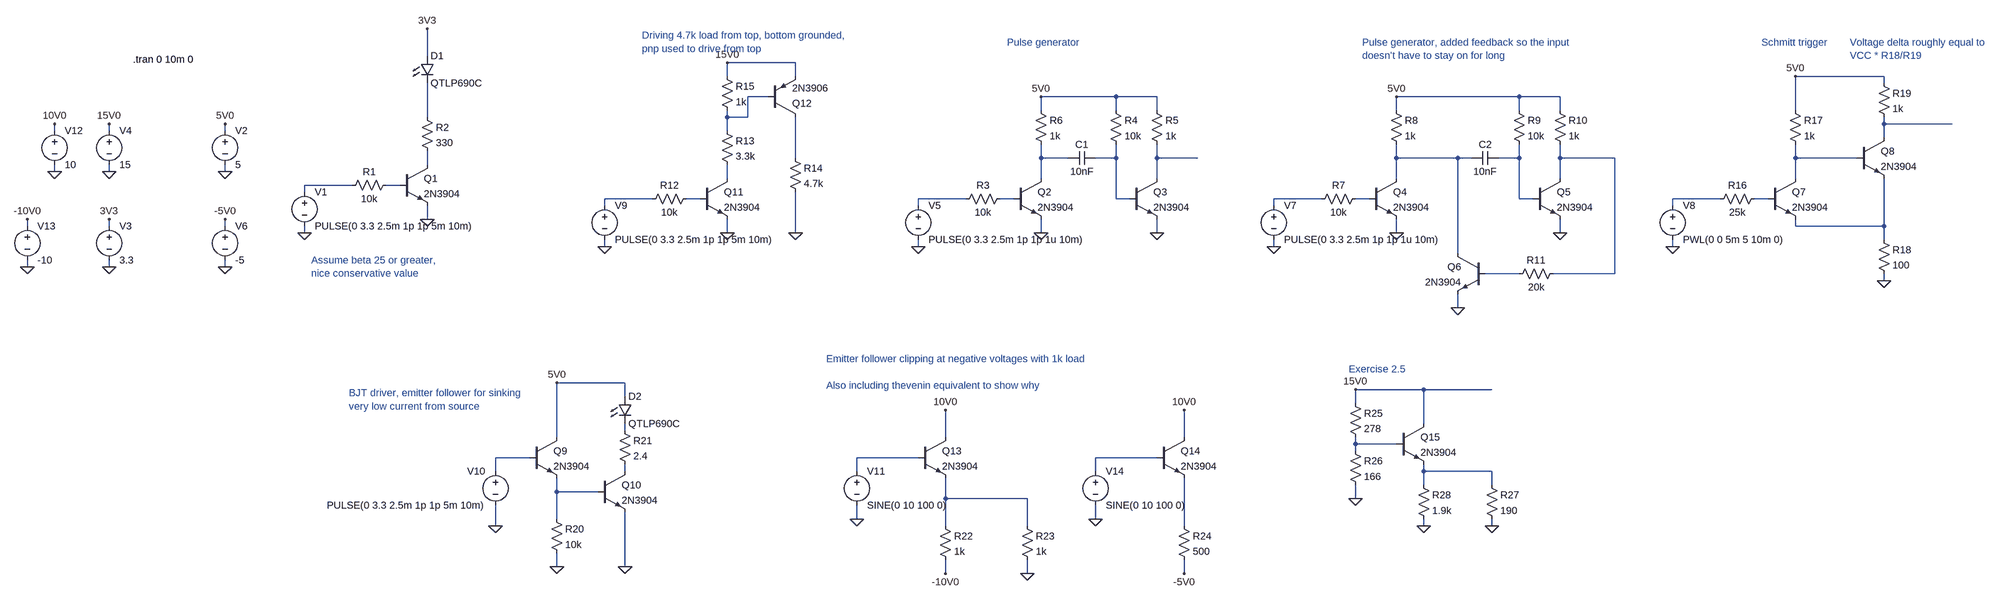
[diagram p0: schematic BJTs.asc]
BJTs.asc, the LTspice schematic file:
Version 4
SHEET 1 4136 1636
WIRE 160 208 160 144
WIRE 1024 224 864 224
WIRE 864 256 864 224
WIRE 1024 256 1024 224
WIRE 3728 256 3520 256
WIRE 3728 272 3728 256
WIRE 960 304 912 304
WIRE 1776 304 1600 304
WIRE 1872 304 1776 304
WIRE 2752 304 2464 304
WIRE 2848 304 2752 304
WIRE 1600 336 1600 304
WIRE 1776 336 1776 304
WIRE 1872 336 1872 304
WIRE 2464 336 2464 304
WIRE 2752 336 2752 304
WIRE 2848 336 2848 304
WIRE 3520 336 3520 256
WIRE 160 352 160 272
WIRE 864 352 864 336
WIRE 912 352 912 304
WIRE 912 352 864 352
WIRE 3728 368 3728 352
WIRE 3888 368 3728 368
WIRE -736 384 -736 368
WIRE -608 384 -608 368
WIRE -336 384 -336 368
WIRE 864 384 864 352
WIRE 3728 400 3728 368
WIRE 1024 448 1024 352
WIRE 1600 448 1600 416
WIRE 1664 448 1600 448
WIRE 1776 448 1776 416
WIRE 1776 448 1728 448
WIRE 1872 448 1872 416
WIRE 1968 448 1872 448
WIRE 2464 448 2464 416
WIRE 2608 448 2464 448
WIRE 2640 448 2608 448
WIRE 2752 448 2752 416
WIRE 2752 448 2704 448
WIRE 2848 448 2848 416
WIRE 2976 448 2848 448
WIRE 3520 448 3520 416
WIRE 3664 448 3520 448
WIRE 160 464 160 432
WIRE -736 480 -736 464
WIRE -608 480 -608 464
WIRE -336 480 -336 464
WIRE 864 496 864 464
WIRE 1600 496 1600 448
WIRE 1872 496 1872 448
WIRE 2464 496 2464 448
WIRE 2848 496 2848 448
WIRE 3520 496 3520 448
WIRE -16 512 -128 512
WIRE 96 512 64 512
WIRE -128 528 -128 512
WIRE 688 544 576 544
WIRE 800 544 768 544
WIRE 1424 544 1312 544
WIRE 1536 544 1504 544
WIRE 1776 544 1776 448
WIRE 1808 544 1776 544
WIRE 2288 544 2176 544
WIRE 2400 544 2368 544
WIRE 2752 544 2752 448
WIRE 2784 544 2752 544
WIRE 3344 544 3232 544
WIRE 3456 544 3424 544
WIRE 576 560 576 544
WIRE 1312 560 1312 544
WIRE 2176 560 2176 544
WIRE 3232 560 3232 544
WIRE 160 592 160 560
WIRE -800 608 -800 592
WIRE -608 608 -608 592
WIRE -336 608 -336 592
WIRE 3520 608 3520 592
WIRE 3728 608 3728 496
WIRE 3728 608 3520 608
WIRE -128 624 -128 608
WIRE 864 624 864 592
WIRE 1024 624 1024 528
WIRE 1600 624 1600 592
WIRE 1872 624 1872 592
WIRE 2464 624 2464 592
WIRE 2848 624 2848 592
WIRE 3728 640 3728 608
WIRE 576 656 576 640
WIRE 1312 656 1312 640
WIRE 2176 656 2176 640
WIRE 3232 656 3232 640
WIRE 2608 672 2608 448
WIRE -800 704 -800 688
WIRE -608 704 -608 688
WIRE -336 704 -336 688
WIRE 2752 720 2672 720
WIRE 2976 720 2976 448
WIRE 2976 720 2832 720
WIRE 3728 736 3728 720
WIRE 2608 800 2608 768
WIRE 624 976 464 976
WIRE 2528 992 2368 992
WIRE 2688 992 2528 992
WIRE 624 1008 624 976
WIRE 2368 1024 2368 992
WIRE 2528 1072 2528 992
WIRE 624 1088 624 1072
WIRE 464 1104 464 976
WIRE 1376 1104 1376 1040
WIRE 1936 1104 1936 1040
WIRE 2368 1120 2368 1104
WIRE 2464 1120 2368 1120
WIRE 2368 1136 2368 1120
WIRE 400 1152 320 1152
WIRE 1312 1152 1168 1152
WIRE 1872 1152 1728 1152
WIRE 320 1184 320 1152
WIRE 624 1184 624 1168
WIRE 1168 1184 1168 1152
WIRE 1728 1184 1728 1152
WIRE 2528 1184 2528 1168
WIRE 2688 1184 2528 1184
WIRE 2528 1216 2528 1184
WIRE 2688 1216 2688 1184
WIRE 464 1232 464 1200
WIRE 560 1232 464 1232
WIRE 1376 1248 1376 1200
WIRE 1568 1248 1376 1248
WIRE 2368 1248 2368 1216
WIRE 464 1296 464 1232
WIRE 1168 1296 1168 1264
WIRE 1728 1296 1728 1264
WIRE 320 1312 320 1264
WIRE 1376 1312 1376 1248
WIRE 1568 1312 1568 1248
WIRE 1936 1312 1936 1200
WIRE 2528 1312 2528 1296
WIRE 2688 1312 2688 1296
WIRE 464 1408 464 1376
WIRE 624 1408 624 1280
WIRE 1376 1424 1376 1392
WIRE 1568 1424 1568 1392
WIRE 1936 1424 1936 1392
FLAG -336 480 0
FLAG -336 368 5V0
FLAG -608 480 0
FLAG -608 368 15V0
FLAG -336 704 0
FLAG -336 592 -5V0
FLAG 160 592 0
FLAG -128 624 0
FLAG -608 704 0
FLAG -608 592 3V3
FLAG 160 144 3V3
FLAG 864 624 0
FLAG 576 656 0
FLAG 864 224 15V0
FLAG 1024 624 0
FLAG 1600 624 0
FLAG 1312 656 0
FLAG 1600 304 5V0
FLAG 1872 624 0
FLAG 2464 624 0
FLAG 2176 656 0
FLAG 2464 304 5V0
FLAG 2848 624 0
FLAG 2608 800 0
FLAG 3232 656 0
FLAG 3728 736 0
FLAG 3520 256 5V0
FLAG 320 1312 0
FLAG 464 1408 0
FLAG 624 1408 0
FLAG 464 976 5V0
FLAG 1376 1424 -10V0
FLAG 1168 1296 0
FLAG -736 480 0
FLAG -736 368 10V0
FLAG 1376 1040 10V0
FLAG -800 704 0
FLAG -800 592 -10V0
FLAG 1568 1424 0
FLAG 1936 1424 -5V0
FLAG 1728 1296 0
FLAG 1936 1040 10V0
FLAG 2368 992 15V0
FLAG 2368 1248 0
FLAG 2528 1312 0
FLAG 2688 1312 0
SYMBOL voltage -336 368 R0
WINDOW 123 0 0 Left 0
WINDOW 39 0 0 Left 0
SYMATTR InstName V2
SYMATTR Value 5
SYMBOL voltage -608 368 R0
WINDOW 123 0 0 Left 0
WINDOW 39 0 0 Left 0
SYMATTR InstName V4
SYMATTR Value 15
SYMBOL voltage -336 592 R0
WINDOW 123 0 0 Left 0
WINDOW 39 0 0 Left 0
SYMATTR InstName V6
SYMATTR Value -5
SYMBOL npn 96 464 R0
SYMATTR InstName Q1
SYMATTR Value 2N3904
SYMBOL res 80 496 R90
WINDOW 0 0 56 VBottom 2
WINDOW 3 32 56 VTop 2
SYMATTR InstName R1
SYMATTR Value 10k
SYMBOL res 144 336 R0
SYMATTR InstName R2
SYMATTR Value 330
SYMBOL voltage -128 512 R0
WINDOW 123 0 0 Left 0
WINDOW 39 0 0 Left 0
SYMATTR InstName V1
SYMATTR Value PULSE(0 3.3 2.5m 1p 1p 5m 10m)
SYMBOL voltage -608 592 R0
WINDOW 123 0 0 Left 0
WINDOW 39 0 0 Left 0
SYMATTR InstName V3
SYMATTR Value 3.3
SYMBOL LED 144 208 R0
SYMATTR InstName D1
SYMATTR Value QTLP690C
SYMATTR Description Diode
SYMATTR Type diode
SYMBOL npn 800 496 R0
SYMATTR InstName Q11
SYMATTR Value 2N3904
SYMBOL res 784 528 R90
WINDOW 0 0 56 VBottom 2
WINDOW 3 32 56 VTop 2
SYMATTR InstName R12
SYMATTR Value 10k
SYMBOL voltage 576 544 R0
WINDOW 123 0 0 Left 0
WINDOW 39 0 0 Left 0
SYMATTR InstName V9
SYMATTR Value PULSE(0 3.3 2.5m 1p 1p 5m 10m)
SYMBOL res 848 368 R0
SYMATTR InstName R13
SYMATTR Value 3.3k
SYMBOL pnp 960 352 M180
SYMATTR InstName Q12
SYMATTR Value 2N3906
SYMBOL res 1008 432 R0
SYMATTR InstName R14
SYMATTR Value 4.7k
SYMBOL res 848 240 R0
SYMATTR InstName R15
SYMATTR Value 1k
SYMBOL npn 1536 496 R0
SYMATTR InstName Q2
SYMATTR Value 2N3904
SYMBOL res 1520 528 R90
WINDOW 0 0 56 VBottom 2
WINDOW 3 32 56 VTop 2
SYMATTR InstName R3
SYMATTR Value 10k
SYMBOL voltage 1312 544 R0
WINDOW 123 0 0 Left 0
WINDOW 39 0 0 Left 0
SYMATTR InstName V5
SYMATTR Value PULSE(0 3.3 2.5m 1p 1p 1u 10m)
SYMBOL res 1584 320 R0
SYMATTR InstName R6
SYMATTR Value 1k
SYMBOL cap 1728 432 R90
WINDOW 0 0 32 VBottom 2
WINDOW 3 32 32 VTop 2
SYMATTR InstName C1
SYMATTR Value 10nF
SYMBOL res 1760 320 R0
SYMATTR InstName R4
SYMATTR Value 10k
SYMBOL npn 1808 496 R0
SYMATTR InstName Q3
SYMATTR Value 2N3904
SYMBOL res 1856 320 R0
SYMATTR InstName R5
SYMATTR Value 1k
SYMBOL npn 2400 496 R0
SYMATTR InstName Q4
SYMATTR Value 2N3904
SYMBOL res 2384 528 R90
WINDOW 0 0 56 VBottom 2
WINDOW 3 32 56 VTop 2
SYMATTR InstName R7
SYMATTR Value 10k
SYMBOL voltage 2176 544 R0
WINDOW 123 0 0 Left 0
WINDOW 39 0 0 Left 0
SYMATTR InstName V7
SYMATTR Value PULSE(0 3.3 2.5m 1p 1p 1u 10m)
SYMBOL res 2448 320 R0
SYMATTR InstName R8
SYMATTR Value 1k
SYMBOL cap 2704 432 R90
WINDOW 0 0 32 VBottom 2
WINDOW 3 32 32 VTop 2
SYMATTR InstName C2
SYMATTR Value 10nF
SYMBOL res 2736 320 R0
SYMATTR InstName R9
SYMATTR Value 10k
SYMBOL npn 2784 496 R0
SYMATTR InstName Q5
SYMATTR Value 2N3904
SYMBOL res 2832 320 R0
SYMATTR InstName R10
SYMATTR Value 1k
SYMBOL npn 2672 672 M0
SYMATTR InstName Q6
SYMATTR Value 2N3904
SYMBOL res 2848 704 R90
WINDOW 0 0 56 VBottom 2
WINDOW 3 32 56 VTop 2
SYMATTR InstName R11
SYMATTR Value 20k
SYMBOL npn 3456 496 R0
SYMATTR InstName Q7
SYMATTR Value 2N3904
SYMBOL res 3440 528 R90
WINDOW 0 0 56 VBottom 2
WINDOW 3 32 56 VTop 2
SYMATTR InstName R16
SYMATTR Value 25k
SYMBOL voltage 3232 544 R0
WINDOW 123 0 0 Left 0
WINDOW 39 0 0 Left 0
SYMATTR InstName V8
SYMATTR Value PWL(0 0 5m 5 10m 0)
SYMBOL res 3504 320 R0
SYMATTR InstName R17
SYMATTR Value 1k
SYMBOL npn 3664 400 R0
SYMATTR InstName Q8
SYMATTR Value 2N3904
SYMBOL res 3712 624 R0
SYMATTR InstName R18
SYMATTR Value 100
SYMBOL res 3712 256 R0
SYMATTR InstName R19
SYMATTR Value 1k
SYMBOL npn 400 1104 R0
SYMATTR InstName Q9
SYMATTR Value 2N3904
SYMBOL voltage 320 1168 M0
WINDOW 123 0 0 Left 0
WINDOW 39 0 0 Left 0
SYMATTR InstName V10
SYMATTR Value PULSE(0 3.3 2.5m 1p 1p 5m 10m)
SYMBOL res 448 1280 R0
SYMATTR InstName R20
SYMATTR Value 10k
SYMBOL npn 560 1184 R0
SYMATTR InstName Q10
SYMATTR Value 2N3904
SYMBOL LED 608 1008 R0
SYMATTR InstName D2
SYMATTR Value QTLP690C
SYMATTR Description Diode
SYMATTR Type diode
SYMBOL res 608 1072 R0
SYMATTR InstName R21
SYMATTR Value 2.4
SYMBOL npn 1312 1104 R0
SYMATTR InstName Q13
SYMATTR Value 2N3904
SYMBOL res 1360 1296 R0
SYMATTR InstName R22
SYMATTR Value 1k
SYMBOL voltage 1168 1168 R0
WINDOW 123 0 0 Left 0
WINDOW 39 0 0 Left 0
SYMATTR InstName V11
SYMATTR Value SINE(0 10 100 0)
SYMBOL voltage -736 368 R0
WINDOW 123 0 0 Left 0
WINDOW 39 0 0 Left 0
SYMATTR InstName V12
SYMATTR Value 10
SYMBOL voltage -800 592 R0
WINDOW 123 0 0 Left 0
WINDOW 39 0 0 Left 0
SYMATTR InstName V13
SYMATTR Value -10
SYMBOL res 1552 1296 R0
SYMATTR InstName R23
SYMATTR Value 1k
SYMBOL npn 1872 1104 R0
SYMATTR InstName Q14
SYMATTR Value 2N3904
SYMBOL res 1920 1296 R0
SYMATTR InstName R24
SYMATTR Value 500
SYMBOL voltage 1728 1168 R0
WINDOW 123 0 0 Left 0
WINDOW 39 0 0 Left 0
SYMATTR InstName V14
SYMATTR Value SINE(0 10 100 0)
SYMBOL res 2352 1008 R0
SYMATTR InstName R25
SYMATTR Value 278
SYMBOL res 2352 1120 R0
SYMATTR InstName R26
SYMATTR Value 166
SYMBOL npn 2464 1072 R0
SYMATTR InstName Q15
SYMATTR Value 2N3904
SYMBOL res 2512 1200 R0
SYMATTR InstName R28
SYMATTR Value 1.9k
SYMBOL res 2672 1200 R0
SYMATTR InstName R27
SYMATTR Value 190
TEXT -552 216 Left 2 !.tran 0 10m 0
TEXT -112 688 Left 2 ;Assume beta 25 or greater,\nnice conservative value
TEXT 1520 176 Left 2 ;Pulse generator
TEXT 664 160 Left 2 ;Driving 4.7k load from top, bottom grounded,\npnp used to drive from top
TEXT 2384 176 Left 2 ;Pulse generator, added feedback so the input\ndoesn't have to stay on for long
TEXT 3440 176 Left 2 ;Schmitt trigger
TEXT 3648 176 Left 2 ;Voltage delta roughly equal to\nVCC * R18/R19
TEXT -24 1000 Left 2 ;BJT driver, emitter follower for sinking\nvery low current from source
TEXT 1096 920 Left 2 ;Emitter follower clipping at negative voltages with 1k load\n \nAlso including thevenin equivalent to show why
TEXT 2352 944 Left 2 ;Exercise 2.5

The netlist it stands for:
* BJTs.asc
V2 5V0 0 5
V4 15V0 0 15
V6 -5V0 0 -5
Q1 N012 N015 0 0 2N3904
R1 N015 N014 10k
R2 N002 N012 330
V1 N014 0 PULSE(0 3.3 2.5m 1p 1p 5m 10m)
V3 3V3 0 3.3
D1 3V3 N002 QTLP690C
Q11 N013 N017 0 0 2N3904
R12 N017 N016 10k
V9 N016 0 PULSE(0 3.3 2.5m 1p 1p 5m 10m)
R13 N001 N013 3.3k
Q12 N004 N001 15V0 0 2N3906
R14 N004 0 4.7k
R15 15V0 N001 1k
Q2 N005 N019 0 0 2N3904
R3 N019 N018 10k
V5 N018 0 PULSE(0 3.3 2.5m 1p 1p 1u 10m)
R6 5V0 N005 1k
C1 N006 N005 10nF
R4 5V0 N006 10k
Q3 N007 N006 0 0 2N3904
R5 5V0 N007 1k
Q4 N008 N021 0 0 2N3904
R7 N021 N020 10k
V7 N020 0 PULSE(0 3.3 2.5m 1p 1p 1u 10m)
R8 5V0 N008 1k
C2 N009 N008 10nF
R9 5V0 N009 10k
Q5 N010 N009 0 0 2N3904
R10 5V0 N010 1k
Q6 N008 N025 0 0 2N3904
R11 N010 N025 20k
Q7 N011 N023 N024 0 2N3904
R16 N023 N022 25k
V8 N022 0 PWL(0 0 5m 5 10m 0)
R17 5V0 N011 1k
Q8 N003 N011 N024 0 2N3904
R18 N024 0 100
R19 5V0 N003 1k
Q9 5V0 N028 N033 0 2N3904
V10 N028 0 PULSE(0 3.3 2.5m 1p 1p 5m 10m)
R20 N033 0 10k
Q10 N031 N033 0 0 2N3904
D2 5V0 N026 QTLP690C
R21 N026 N031 2.4
Q13 10V0 N029 N034 0 2N3904
R22 N034 -10V0 1k
V11 N029 0 SINE(0 10 100 0)
V12 10V0 0 10
V13 -10V0 0 -10
R23 N034 0 1k
Q14 10V0 N030 N035 0 2N3904
R24 N035 -5V0 500
V14 N030 0 SINE(0 10 100 0)
R25 15V0 N027 278
R26 N027 0 166
Q15 15V0 N027 N032 0 2N3904
R28 N032 0 1.9k
R27 N032 0 190
.model D D
.lib standard.dio
.model NPN NPN
.model PNP PNP
.lib standard.bjt
.tran 0 10m 0
* Assume beta 25 or greater,
* nice conservative value
* Pulse generator
* Driving 4.7k load from top, bottom grounded,
* pnp used to drive from top
* Pulse generator, added feedback so the input
* doesn't have to stay on for long
* Schmitt trigger
* Voltage delta roughly equal to
* VCC * R18/R19
* BJT driver, emitter follower for sinking
* very low current from source
* Emitter follower clipping at negative voltages with 1k load
* Also including thevenin equivalent to show why
* Exercise 2.5
.backanno
.end